# Altium project Vectra_bluetooth.PrjPcb
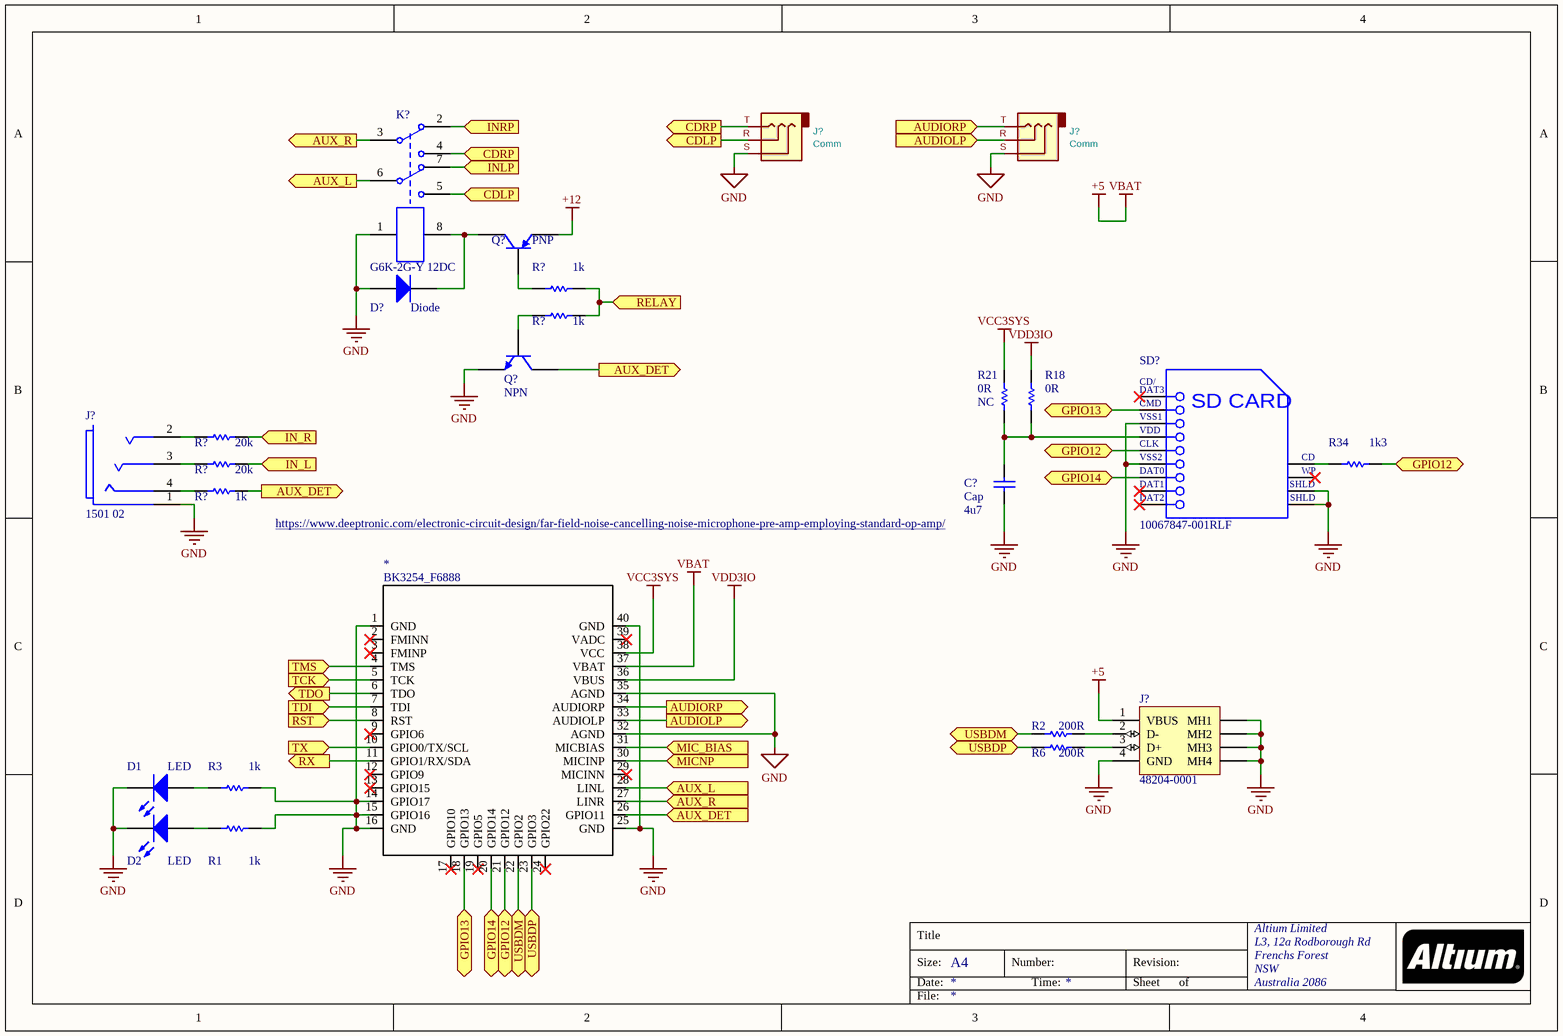
[diagram p0: Vectra_bluetooth.SchDoc]
1 sheet, 25 parts. Net scope: flat (ports and power ports of the same name join across sheets).
Board file: Vectra_bluetooth.PcbDoc

## Sheet Vectra_bluetooth.SchDoc
size A4; Organization: Altium Limited; Address1: L3, 12a Rodborough Rd; Address2: Frenchs Forest; Address3: NSW; Address4: Australia 2086

### Parts
(Parts that share a designator on the sheet are numbered #1, #2 ... from top to bottom, then left to right.)
*  BK3254_F6888
C?  Cap  value 4u7  [RAD-0.3]
D1  LED  [3.2X1.6X1.1]
D2  LED  [3.2X1.6X1.1]
D?  Diode  [SMC]
J?#1  Comm  [1503_08]
J?#2  Comm  [1503_08]
J?#3  1501 02  [FP-SJ2-3574A-SMT-TR-MFG]
J?#4  48204-0001  [MOLX-48204-0001_V]
K?  G6K-2G-Y 12DC  [TECO-IMXXXGX-8_V]
Q?#1  PNP  [SOT-23B_N]
Q?#2  NPN  [TO-226-AA]
R1  value 1k  [AXIAL-0.3]  (hidden comment: Res1)
R2  value 200R  [AXIAL-0.3]  (hidden comment: Res1)
R3  value 1k  [AXIAL-0.3]  (hidden comment: Res1)
R6  value 200R  [AXIAL-0.3]  (hidden comment: Res1)
R18  value 0R  [AXIAL-0.3]  (hidden comment: Res1)
R21  NC  value 0R  [AXIAL-0.3]
R34  value 1k3  [AXIAL-0.3]  (hidden comment: Res1)
R?#1  value 1k  [AXIAL-0.3]  (hidden comment: Res1)
R?#2  value 1k  [AXIAL-0.3]  (hidden comment: Res1)
R?#3  value 20k  [AXIAL-0.3]  (hidden comment: Res1)
R?#4  value 20k  [AXIAL-0.3]  (hidden comment: Res1)
R?#5  value 1k  [AXIAL-0.3]  (hidden comment: Res1)
SD?  10067847-001RLF  [FCI-10067847-001RLF_V]

### Ports
AUDIOLP (in), AUDIOLP (out), AUDIORP (in), AUDIORP (out), AUX_DET (in), AUX_DET (out), AUX_L (in), AUX_L (out), AUX_R (in), AUX_R (out), CDLP (in), CDLP (out), CDRP (in), CDRP (out), GPIO12 (bidir), GPIO13 (bidir), GPIO14 (bidir), IN_L (in), IN_R (in), INLP (in), INRP (in), MIC_BIAS (in), MICNP (in), RELAY (in), RST (in), RX (out), TCK (in), TDI (in), TDO (out), TMS (in), TX (in), USBDM (bidir), USBDP (bidir)

### Nets
+5: *.37(VBAT) J?#4.1(VBUS)  [also labelled VBAT]
+12: Q?#1.3(E)
GND: *.1(GND) *.14(GPIO17) *.15(GPIO16) *.16(GND) *.25(GND) *.32(AGND) *.35(AGND) *.40(GND) C?.1 D1.2(K) D2.2(K) D?.1(A) J?#1.S J?#2.S J?#3.1(sleeve) J?#4.4(GND) J?#4.MH1 J?#4.MH2 J?#4.MH3 J?#4.MH4 K?.1 Q?#2.3(E) R1.2 R3.2 SD?.3(VSS1) SD?.6(VSS2) SD?.12(SHLD1) SD?.13(SHLD2)
VCC3SYS: *.38(VCC) R21.2
VDD3IO: *.36(VBUS) R18.2
Net*_4: *.4(TMS) ; port TMS
Net*_5: *.5(TCK) ; port TCK
Net*_6: *.6(TDO) ; port TDO
Net*_7: *.7(TDI) ; port TDI
Net*_8: *.8(RST) ; port RST
Net*_10: *.10(GPIO0/TX/SCL) ; port TX
Net*_11: *.11(GPIO1/RX/SDA) ; port RX
Net*_18: *.18(GPIO13) SD?.2(CMD) ; port GPIO13
Net*_20: *.20(GPIO14) SD?.7(DAT0) ; port GPIO14
Net*_21: *.21(GPIO12) R34.2 SD?.5(CLK) ; port GPIO12
Net*_22: *.22(GPIO2) R2.1 ; port USBDM
Net*_23: *.23(GPIO3) R6.1 ; port USBDP
Net*_26: *.26(GPIO11) Q?#2.1(C) R?#5.2 ; port AUX_DET
Net*_27: *.27(LINR) K?.3 ; port AUX_R
Net*_28: *.28(LINL) K?.6 ; port AUX_L
Net*_30: *.30(MICINP) ; port MICNP
Net*_31: *.31(MICBIAS) ; port MIC_BIAS
Net*_33: *.33(AUDIOLP) J?#2.R ; port AUDIOLP
Net*_34: *.34(AUDIORP) J?#2.T ; port AUDIORP
NetC?_2: C?.2 R18.1 R21.1 SD?.4(VDD)
NetD1_1: D1.1(A) R3.1
NetD2_1: D2.1(A) R1.1
NetD?_2: D?.2(K) K?.8 Q?#1.1(C)
NetJ?#1_R: J?#1.R K?.5 ; port CDLP
NetJ?#1_T: J?#1.T K?.4 ; port CDRP
NetJ?#3_2: J?#3.2(tip) R?#3.1
NetJ?#3_3: J?#3.3(ring_1) R?#4.1
NetJ?#3_4: J?#3.4(ring_2) R?#5.1
NetJ?#4_2: J?#4.2(D-) R2.2
NetJ?#4_3: J?#4.3(D+) R6.2
NetK?_2: K?.2 ; port INRP
NetK?_7: K?.7 ; port INLP
NetQ?#1_2: Q?#1.2(B) R?#1.1
NetQ?#2_2: Q?#2.2(B) R?#2.1
NetR34_1: R34.1 SD?.10(CD)
NetR?#1_2: R?#1.2 R?#2.2 ; port RELAY
NetR?#3_2: R?#3.2 ; port IN_R
NetR?#4_2: R?#4.2 ; port IN_L

Not connected (* = marked no-connect by the designer): * 2(FMINN)* 3(FMINP)* 9(GPIO6)* 12(GPIO9)* 13(GPIO15)* 17(GPIO10)* 19(GPIO5)* 24(GPIO22)* 29(MICINN)* 39(VADC)*; SD? 1(CD/DAT3)* 8(DAT1)* 9(DAT2)* 11(WP)*

### Notes on the sheet
- (near C?) https://www.deeptronic.com/electronic-circuit-design/far-field-noise-cancelling-noise-microphone-pre-amp-employing-standard-op-amp/
- Title
- Size:
- Date:
- A4
- Number:
- Time:
- Revision:
- Sheet
- of
- File:
- (in symbol CMP-2000-05818-1) CD/; DAT3; SD CARD; SHLD

### Library data of the parts
C? = Cap: Capacitor; Published: 8-Jun-2000; LatestRevisionDate: 17-Jul-2002; LatestRevisionNote: Re-released for DXP Platform.; PackageReference: RAD-0.3; Publisher: Altium Limited; PackageDescription: Radial Cap, Thru-Hole; 2 Leads; 0.3 in Pin Spacing
D1 D2 = LED2: Typical RED, GREEN, YELLOW, AMBER GaAs LED; Published: 8-Jun-2000; LatestRevisionDate: 17-Jul-2002; LatestRevisionNote: Re-released for DXP Platform.; PackageVersion: Feb-2002; PackageReference: 3.2X1.6X1.1; Publisher: Altium Limited; PackageDescription: SM LED; 2 Flat Leads
D? = Diode: Default Diode; Published: 8-Jun-2000; LatestRevisionDate: 17-Jul-2002; LatestRevisionNote: Re-released for DXP Platform.; PackageVersion: Sep-1996; PackageReference: SMC; Publisher: Altium Limited; PackageDescription: DO-214-AB/SMC; 2 C-Bend Leads; Body 7.9 x 5.9 mm, inc. leads (LxW); Code_JEDEC: DO-214-AB
J?#1 J?#2 = AudioJack3: pin to pad: R>3 S>1 T>2; Value: Comm
J?#3 = CMP-14818-000001-1: AUDIO JACK, 3.5 MM, RT, 4 CONDUC; Manufacturer: CUI; Manufacturer Part Number: SJ2-3574A-SMT-TR; Conn Orientation: Horizontal; Current Rating: 1A; Number Of Contacts: 4; Voltage Rating: 12V; Package: SJ2-3574A-SMT-TR; Device Class L1: Connectors; Lead Free: Yes; Digikey Description: AUDIO JACK, 3.5 MM, RT, 4 CONDUC; Device Class L2: Audio / Video Connectors; ComponentLink2URL: https://www.cui.com/product/resource/sj2-357x-smt.pdf; Automotive: No; RoHS: TRUE; Height: 5.3mm; Temperature Range Low: -25°C; Category: Conn; Temperature: -25°C to +85°C; Octopart: https://octopart.com/sj2-3574a-smt-tr-cui-77838840; Device Class L3: unset; Contact Material: Silver; Temperature Range High: +85°C; ComponentLink2Description: Datasheet
J?#4 = CMP-0411-00001-2: USB Shielded I/O Receptacle, Type A; Required PB Thickness: 1.6 mm; ComponentLink2URL: http://www.molex.com/pdm_docs/sd/482040001_sd.pdf; PartNumber: 48204-0001; Contact Finish: Bronze; PackageDescription: USB Type-A Up-Right Reverse Connector; ComponentLink1URL: http://www.molex.com/; ComponentLink2Description: Datasheet; DatasheetVersion: Rev D, 04/2006; ComponentLink1Description: Manufacturer URL; Mounting Technology: Through Hole
K? = CMP-2000-05603-1: Manufacturer: TE Connectivity; Coil Current: 8.33mA; Dropout Volt (Min): 2.4VDC; Seal: Unsealed; Product Depth (mm): 7.5mm; Push To Test Button: No; Maximum Power Rating: 60W/62.5VA; Pick-up Voltage (Max): 18VDC; Coil Resistance: 2880ohm; Contact Form: 2FormC; Product Length (mm): 10mm; Operate Time: 1ms; DELETED: Compliant; Voltage Rating (VAC): 250V; Product Height (mm): 5.65mm; Contact Arrangement: DPDT; Coil Voltage DC: 24V; Contact Current Rating: 2A; Voltage Rating (VDC): 220V; Relay Construction: Non-Latching; Package Reference: IM-G-8; Termination Style: GullWing; Packaging: TapeandReel; Package Description: 8-Pin Surface Mount Device, Body 10 x 6 mm, Height 5.65 mm; Type: SignalRelay; Datasheet URL: http://www.te.com/commerce/DocumentDelivery/DDEController?Action=showdoc&DocId=Specification+Or+Standard%7F108-98001%7FW%7Fpdf%7FEnglish%7FENG_SS_108-98001_W.pdf%7F4-1462037-7; Dropout Volt: 2.4VDC; Rad Hardened: No; Coil Suppression Diode: No; Pin Count: 8; Operating Temp Range: -40Cto85C; LED Indicator: No; Mounting Style: SurfaceMount; Manufacturer URL: http://www.te.com/; Contact Material: PdRu/Au; Mounting Technology: SurfaceMount; Datasheet Version: Rev. 0116, 01/2016
Q?#1 = PNP: PNP Bipolar Transistor; Published: 8-Jun-2000; LatestRevisionDate: 29-May-2009; LatestRevisionNote: IPC-7351 Footprint Added.; PackageVersion: Aug-1999; PackageReference: SOT-23B; Publisher: Altium Limited; PackageDescription: 3-Pin SOT-23 Package 0.95 mm Pitch, 2.4 mm Lead Span
Q?#2 = NPN: NPN Bipolar Transistor; Published: 8-Jun-2000; LatestRevisionDate: 17-Jul-2002; LatestRevisionNote: Re-released for DXP Platform.; PackageReference: TO-226-AA; Publisher: Altium Limited; PackageDescription: TO, Flat Index; 3 In-Line, Axial Leads; Body Dia. 4.8mm; Leads 0.55 x 0.51 mm (max); Code_JEDEC: TO-226-AA
R1-R3 R6 R18 R21 R34 R?#1-R?#5 = Res1: Resistor; Published: 8-Jun-2000; LatestRevisionDate: 17-Jul-2002; LatestRevisionNote: Re-released for DXP Platform.; PackageReference: AXIAL-0.3; Publisher: Altium Limited; PackageDescription: Axial Device, Thru-Hole; 2 Leads; 0.3 in Pin Spacing
SD? = CMP-2000-05818-1: Assembly SD Card Reader, Famale, 11 Way, -40 to 105 degC, RoHS, Tape and Reel; Manufacturer: FCI Electronics; SVHC: NoSVHC(15-Jun-2015); Connector Type: MemoryCard; No. of Contacts: 11Contacts; Datasheet Version: Rev. K, 09/2014; Datasheet URL: https://datasheet.ciiva.com/1106/10067847-1106690.pdf; Package Reference: 10067847-001RLF; Product Range: -; Contact Material: CopperAlloy; Contact Plating: GoldPlatedContacts; Package Description: 11-Pin Surface Mount Device, Body 29 x 28.5 mm; Mounting Technology: SurfaceMount; Manufacturer URL: http://portal.fciconnect.com/